# EAGLE schematic 2final (EAGLE 9.5.2)
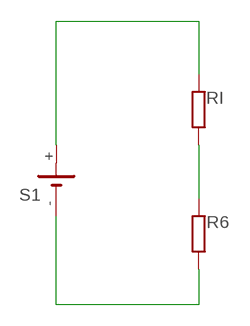
[diagram p0: schematic, sheet 1]

## Parts
R6  570R  R-EU_0204/7  [0204/7]
RI  220R  R-EU_0204/7  [0204/7]
S1  CH291-1220LF  [CH291-1220LF]

## Nets
N$1: RI.2 S1.+
N$2: R6.2 RI.1
N$3: R6.1 S1.-

## Library data of the parts
R6 RI = rcl:R-EU_: RESISTOR, European symbol; SPICEPREFIX: R
S1 = battery:CH291-1220LF: Battery Holder, SMT, 12mm multicomp PART NO. CH291-1220LF Source: Data sheet <http://www.farnell.com/datasheets/1505860.pdf>